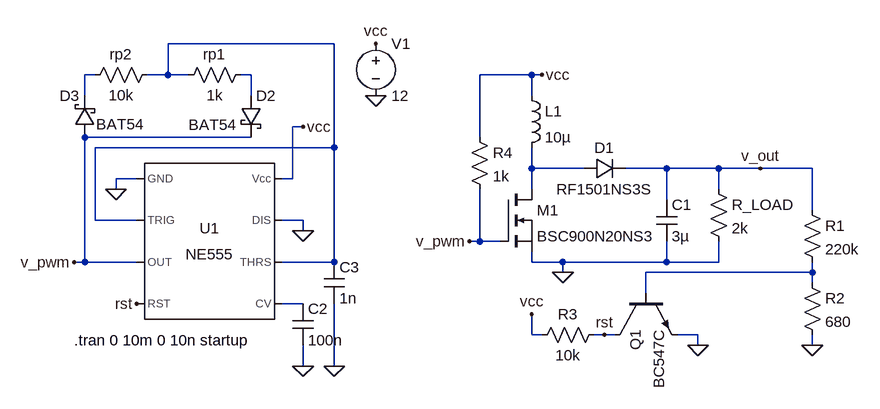
[diagram p0: schematic dc_dc boost.asc]
dc_dc boost.asc, the LTspice schematic file:
Version 4
SHEET 1 1568 680
WIRE 320 -240 64 -240
WIRE -48 -192 -64 -192
WIRE 64 -192 64 -240
WIRE 64 -192 32 -192
WIRE 96 -192 64 -192
WIRE 192 -192 176 -192
WIRE 624 -192 544 -192
WIRE 640 -192 624 -192
WIRE -64 -160 -64 -192
WIRE 192 -160 192 -192
WIRE 624 -160 624 -192
WIRE 272 -112 256 -112
WIRE 192 -96 -64 -96
WIRE 544 -96 544 -192
WIRE 320 -80 320 -240
WIRE 320 -80 -48 -80
WIRE 624 -48 624 -80
WIRE 704 -48 624 -48
WIRE 832 -48 768 -48
WIRE 912 -48 832 -48
WIRE 976 -48 912 -48
WIRE 1056 -48 976 -48
WIRE 16 -32 -16 -32
WIRE 256 -32 256 -112
WIRE 256 -32 240 -32
WIRE -16 -16 -16 -32
WIRE 624 -16 624 -48
WIRE 912 -16 912 -48
WIRE 832 0 832 -48
WIRE 1056 16 1056 -48
WIRE -48 32 -48 -80
WIRE 16 32 -48 32
WIRE 272 32 240 32
WIRE 272 48 272 32
WIRE 544 64 544 -16
WIRE 544 64 528 64
WIRE 576 64 544 64
WIRE -64 96 -64 -96
WIRE -64 96 -80 96
WIRE 16 96 -64 96
WIRE 320 96 320 -80
WIRE 320 96 240 96
WIRE 624 96 624 80
WIRE 672 96 624 96
WIRE 832 96 832 64
WIRE 832 96 672 96
WIRE 912 96 912 64
WIRE 912 96 832 96
WIRE 672 112 672 96
WIRE 1056 112 1056 96
WIRE 1056 112 800 112
WIRE 1056 128 1056 112
WIRE 800 144 800 112
WIRE 272 160 240 160
WIRE 624 208 624 176
WIRE 640 208 624 208
WIRE 736 208 720 208
WIRE 752 208 736 208
WIRE 880 208 848 208
WIRE 880 224 880 208
WIRE 1056 224 1056 208
WIRE 272 256 272 224
WIRE 320 256 320 160
FLAG 640 -192 vcc
FLAG 976 -48 v_out
FLAG 384 -240 vcc
FLAG 384 -160 0
FLAG -16 -16 0
FLAG 272 48 0
FLAG 320 256 0
FLAG -80 96 v_pwm
FLAG 272 -112 vcc
FLAG 1056 224 0
FLAG 528 64 v_pwm
FLAG 272 256 0
FLAG 16 160 rst
FLAG 880 224 0
FLAG 624 176 vcc
FLAG 736 208 rst
FLAG 672 112 0
SYMBOL nmos 576 -16 R0
SYMATTR InstName M1
SYMATTR Value BSC900N20NS3
SYMBOL ind 608 -176 R0
SYMATTR InstName L1
SYMATTR Value 10µ
SYMBOL diode 704 -32 R270
WINDOW 0 32 32 VTop 2
WINDOW 3 0 32 VBottom 2
SYMATTR InstName D1
SYMATTR Value RF1501NS3S
SYMBOL res 896 -32 R0
SYMATTR InstName R_LOAD
SYMATTR Value 2k
SYMBOL cap 816 0 R0
SYMATTR InstName C1
SYMATTR Value 3µ
SYMATTR SpiceLine V=200 Irms=5.06 Rser=0.0268854 Lser=0
SYMBOL voltage 384 -256 R0
WINDOW 123 0 0 Left 2
WINDOW 39 24 44 Left 2
SYMATTR InstName V1
SYMATTR Value 12
SYMBOL Misc\\NE555 128 64 R0
SYMATTR InstName U1
SYMBOL res 192 -208 R90
WINDOW 0 0 56 VBottom 2
WINDOW 3 32 56 VTop 2
SYMATTR InstName rp1
SYMATTR Value 1k
SYMBOL res 48 -208 R90
WINDOW 0 0 56 VBottom 2
WINDOW 3 32 56 VTop 2
SYMATTR InstName rp2
SYMATTR Value 10k
SYMBOL schottky 176 -160 R0
WINDOW 3 -80 45 Left 2
SYMATTR Value BAT54
SYMATTR InstName D2
SYMATTR Description Diode
SYMATTR Type diode
SYMBOL schottky -48 -96 R180
WINDOW 0 24 64 Left 2
WINDOW 3 -75 20 Left 2
SYMATTR InstName D3
SYMATTR Value BAT54
SYMATTR Description Diode
SYMATTR Type diode
SYMBOL cap 304 96 R0
SYMATTR InstName C3
SYMATTR Value 1n
SYMBOL res 1040 0 R0
SYMATTR InstName R1
SYMATTR Value 220k
SYMBOL res 1040 112 R0
SYMATTR InstName R2
SYMATTR Value 680
SYMBOL cap 256 160 R0
SYMATTR InstName C2
SYMATTR Value 100n
SYMBOL res 528 -112 R0
SYMATTR InstName R4
SYMATTR Value 1k
SYMBOL npn 752 144 M90
SYMATTR InstName Q1
SYMATTR Value BC547C
SYMBOL res 736 192 R90
WINDOW 0 0 56 VBottom 2
WINDOW 3 32 56 VTop 2
SYMATTR InstName R3
SYMATTR Value 10k
TEXT -80 216 Left 2 !.tran 0 10m 0 10n startup

The netlist it stands for:
* dc_dc boost.asc
M1 N004 v_pwm 0 0 BSC900N20NS3
L1 vcc N004 10µ
D1 N004 v_out RF1501NS3S
R_LOAD v_out 0 2k
C1 v_out 0 3µ V=200 Irms=5.06 Rser=0.0268854 Lser=0
V1 vcc 0 12
XU1 0 N001 v_pwm rst N006 N001 0 vcc NE555  ; pins GND TRIG OUT RST CV THRS DIS Vcc
rp1 N003 N001 1k
rp2 N001 N002 10k
D2 N003 v_pwm BAT54
D3 v_pwm N002 BAT54
C3 N001 0 1n
R1 v_out N005 220k
R2 N005 0 680
C2 N006 0 100n
R4 vcc v_pwm 1k
Q1 rst N005 0 0 BC547C
R3 rst vcc 10k
.model D D
.lib standard.dio
.model NPN NPN
.model PNP PNP
.lib standard.bjt
.model NMOS NMOS
.model PMOS PMOS
.lib standard.mos
.tran 0 10m 0 10n startup
.lib NE555.sub
.backanno
.end